# EAGLE design pck100clone (EAGLE 6.6.0)
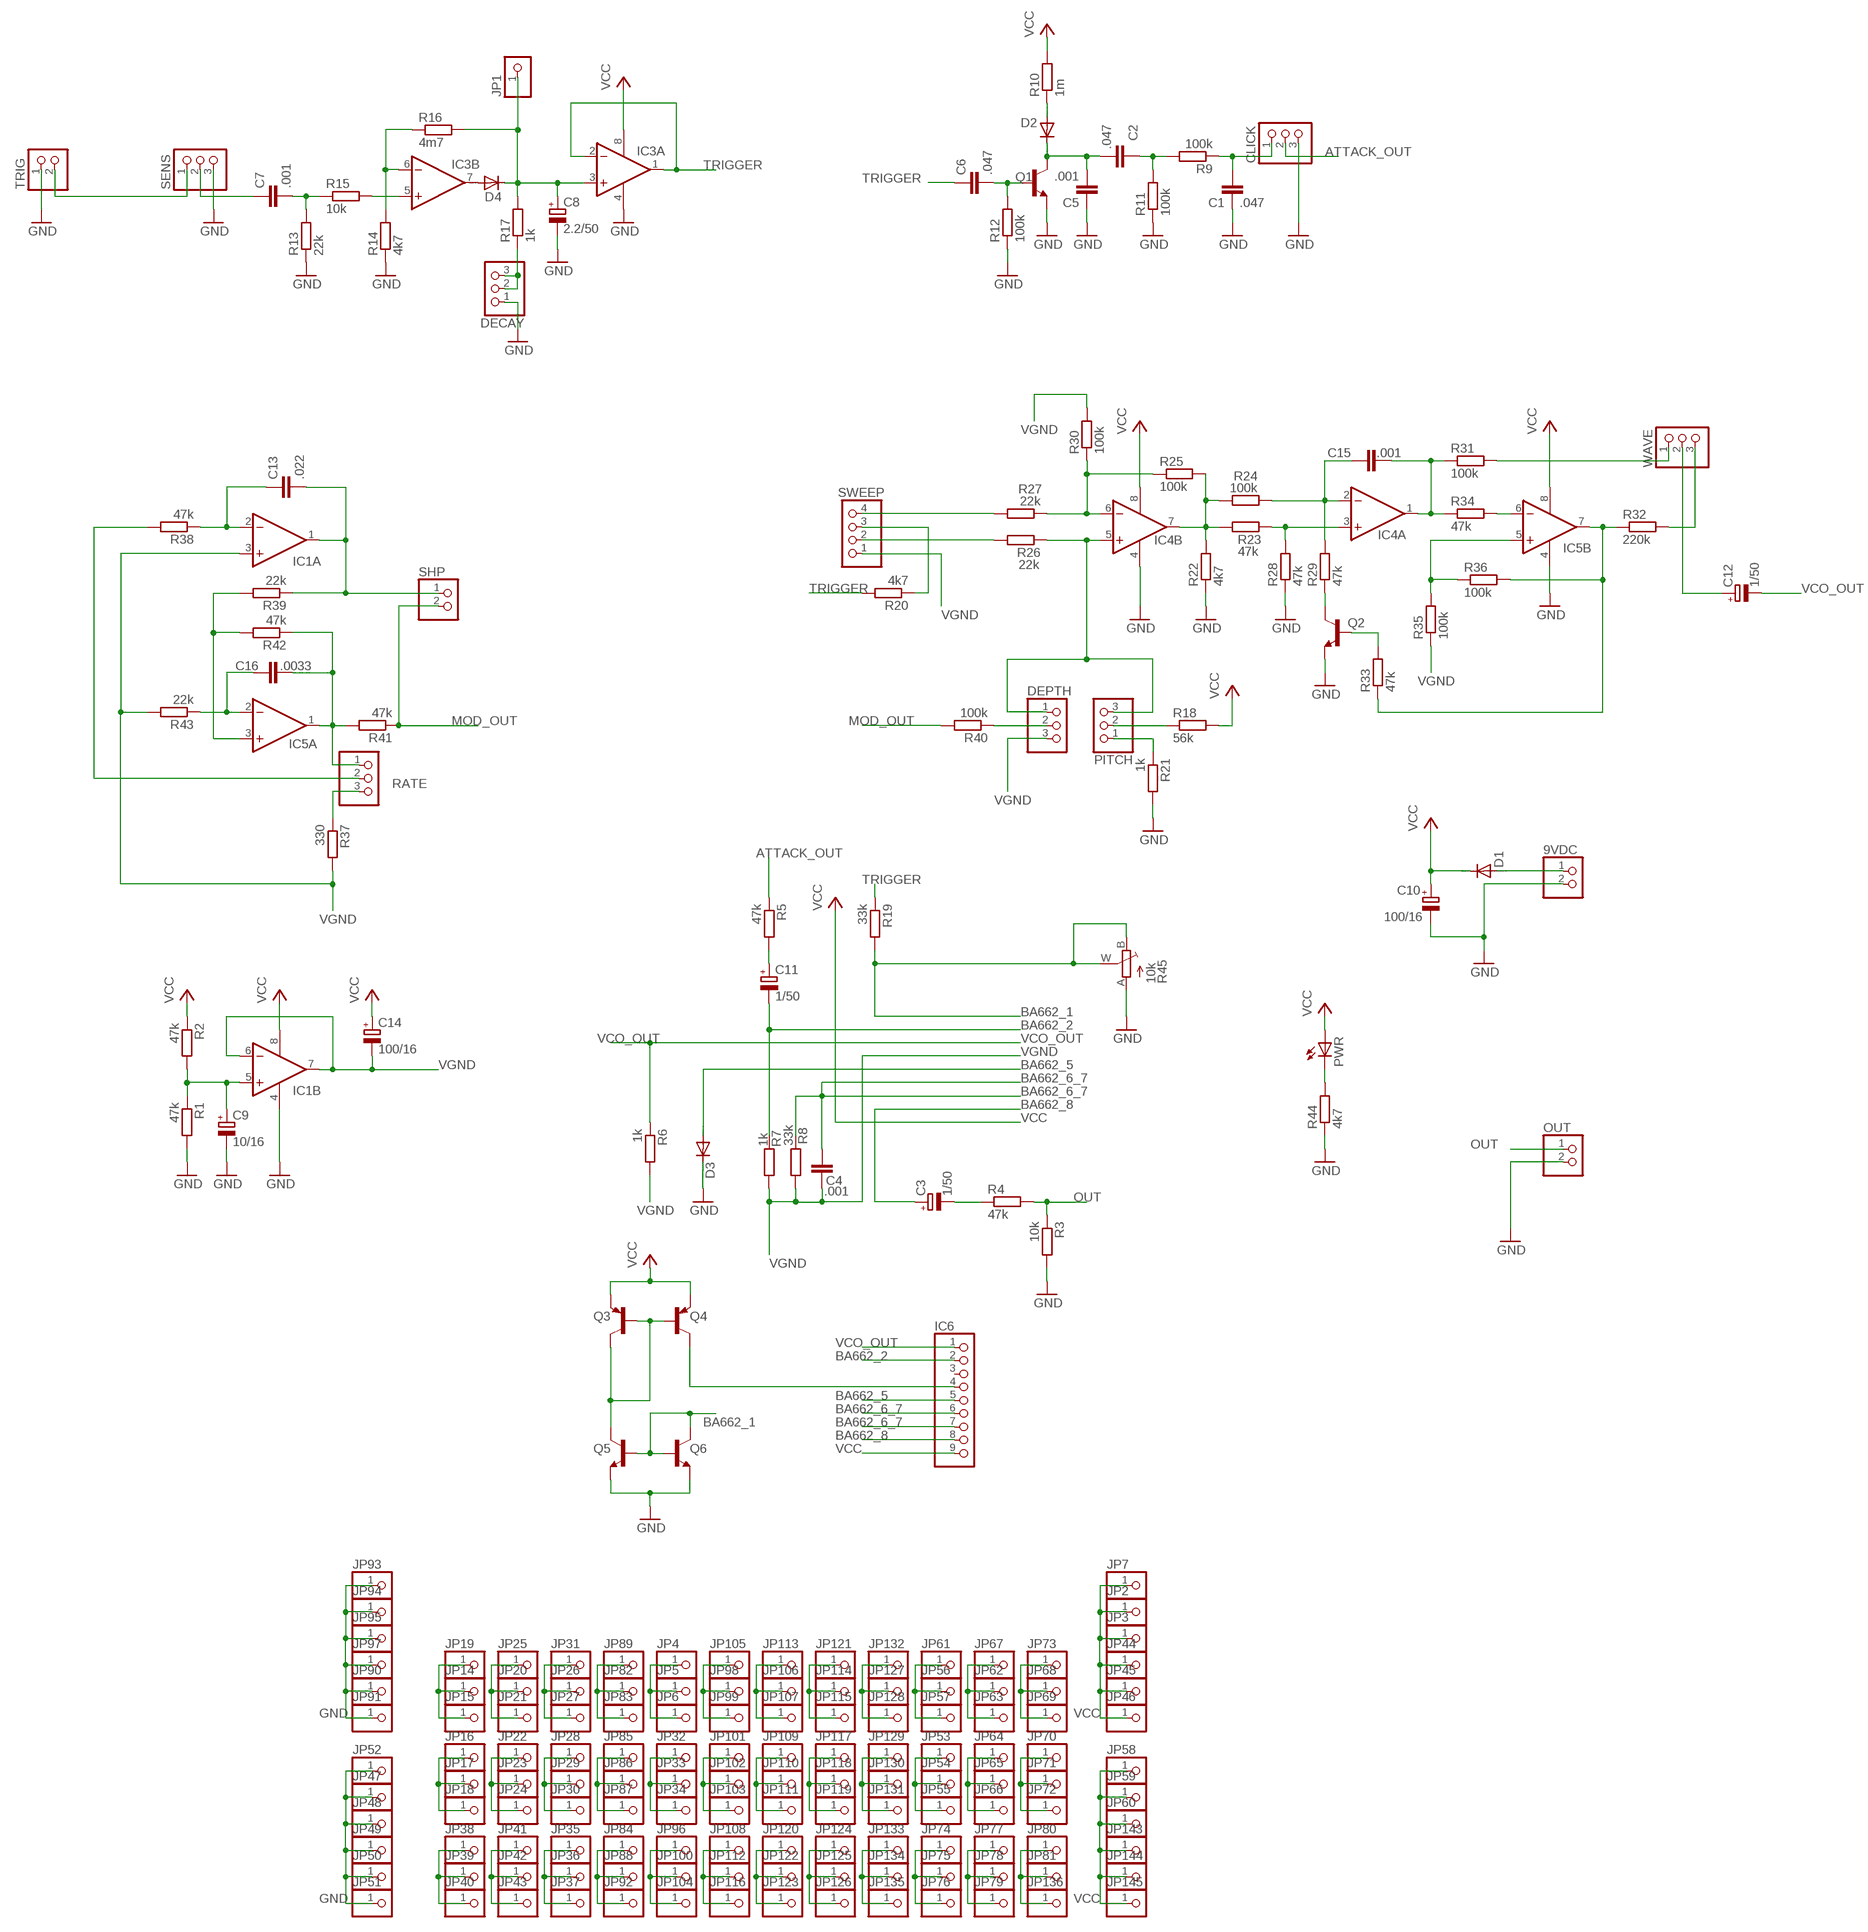
[diagram p0: schematic, sheet 1]

## Parts
9VDC  PINHD-1X2  [1X02]
C1  .047  C-EU050-025X075  [C050-025X075]
C2  .047  C-EU050-025X075  [C050-025X075]
C3  1/50  CPOL-EUE2.5-5  [E2,5-5]
C4  .001  C-EU050-025X075  [C050-025X075]
C5  .001  C-EU050-025X075  [C050-025X075]
C6  .047  C-EU050-025X075  [C050-025X075]
C7  .001  C-EU050-025X075  [C050-025X075]
C8  2.2/50  CPOL-EUE2.5-5  [E2,5-5]
C9  10/16  CPOL-EUE2.5-5  [E2,5-5]
C10  100/16  CPOL-EUE2.5-5  [E2,5-5]
C11  1/50  CPOL-EUE2.5-5  [E2,5-5]
C12  1/50  CPOL-EUE2.5-5  [E2,5-5]
C13  .022  C-EU050-025X075  [C050-025X075]
C14  100/16  CPOL-EUE2.5-5  [E2,5-5]
C15  .001  C-EU050-025X075  [C050-025X075]
C16  .0033  C-EU050-025X075  [C050-025X075]
CLICK  PINHD-1X3  [1X03]
D1  1N4004  [DO41-10]
D2  1N4148DO35-7  [DO35-7]
D3  1N4148DO35-7  [DO35-7]
D4  1N4148DO35-7  [DO35-7]
DECAY  PINHD-1X3  [1X03]
DEPTH  PINHD-1X3  [1X03]
IC1  LM358N  [DIL08]
IC3  LM358N  [DIL08]
IC4  LM358N  [DIL08]
IC5  LM358N  [DIL08]
IC6  PINHD-1X9  [1X09]
JP1  PINHD-1X1  [1X01]
JP2  PINHD-1X1  [1X01]
JP3  PINHD-1X1  [1X01]
JP4  PINHD-1X1  [1X01]
JP5  PINHD-1X1  [1X01]
JP6  PINHD-1X1  [1X01]
JP7  PINHD-1X1  [1X01]
JP14  PINHD-1X1  [1X01]
JP15  PINHD-1X1  [1X01]
JP16  PINHD-1X1  [1X01]
JP17  PINHD-1X1  [1X01]
JP18  PINHD-1X1  [1X01]
JP19  PINHD-1X1  [1X01]
JP20  PINHD-1X1  [1X01]
JP21  PINHD-1X1  [1X01]
JP22  PINHD-1X1  [1X01]
JP23  PINHD-1X1  [1X01]
JP24  PINHD-1X1  [1X01]
JP25  PINHD-1X1  [1X01]
JP26  PINHD-1X1  [1X01]
JP27  PINHD-1X1  [1X01]
JP28  PINHD-1X1  [1X01]
JP29  PINHD-1X1  [1X01]
JP30  PINHD-1X1  [1X01]
JP31  PINHD-1X1  [1X01]
JP32  PINHD-1X1  [1X01]
JP33  PINHD-1X1  [1X01]
JP34  PINHD-1X1  [1X01]
JP35  PINHD-1X1  [1X01]
JP36  PINHD-1X1  [1X01]
JP37  PINHD-1X1  [1X01]
JP38  PINHD-1X1  [1X01]
JP39  PINHD-1X1  [1X01]
JP40  PINHD-1X1  [1X01]
JP41  PINHD-1X1  [1X01]
JP42  PINHD-1X1  [1X01]
JP43  PINHD-1X1  [1X01]
JP44  PINHD-1X1  [1X01]
JP45  PINHD-1X1  [1X01]
JP46  PINHD-1X1  [1X01]
JP47  PINHD-1X1  [1X01]
JP48  PINHD-1X1  [1X01]
JP49  PINHD-1X1  [1X01]
JP50  PINHD-1X1  [1X01]
JP51  PINHD-1X1  [1X01]
JP52  PINHD-1X1  [1X01]
JP53  PINHD-1X1  [1X01]
JP54  PINHD-1X1  [1X01]
JP55  PINHD-1X1  [1X01]
JP56  PINHD-1X1  [1X01]
JP57  PINHD-1X1  [1X01]
JP58  PINHD-1X1  [1X01]
JP59  PINHD-1X1  [1X01]
JP60  PINHD-1X1  [1X01]
JP61  PINHD-1X1  [1X01]
JP62  PINHD-1X1  [1X01]
JP63  PINHD-1X1  [1X01]
JP64  PINHD-1X1  [1X01]
JP65  PINHD-1X1  [1X01]
JP66  PINHD-1X1  [1X01]
JP67  PINHD-1X1  [1X01]
JP68  PINHD-1X1  [1X01]
JP69  PINHD-1X1  [1X01]
JP70  PINHD-1X1  [1X01]
JP71  PINHD-1X1  [1X01]
JP72  PINHD-1X1  [1X01]
JP73  PINHD-1X1  [1X01]
JP74  PINHD-1X1  [1X01]
JP75  PINHD-1X1  [1X01]
JP76  PINHD-1X1  [1X01]
JP77  PINHD-1X1  [1X01]
JP78  PINHD-1X1  [1X01]
JP79  PINHD-1X1  [1X01]
JP80  PINHD-1X1  [1X01]
JP81  PINHD-1X1  [1X01]
JP82  PINHD-1X1  [1X01]
JP83  PINHD-1X1  [1X01]
JP84  PINHD-1X1  [1X01]
JP85  PINHD-1X1  [1X01]
JP86  PINHD-1X1  [1X01]
JP87  PINHD-1X1  [1X01]
JP88  PINHD-1X1  [1X01]
JP89  PINHD-1X1  [1X01]
JP90  PINHD-1X1  [1X01]
JP91  PINHD-1X1  [1X01]
JP92  PINHD-1X1  [1X01]
JP93  PINHD-1X1  [1X01]
JP94  PINHD-1X1  [1X01]
JP95  PINHD-1X1  [1X01]
JP96  PINHD-1X1  [1X01]
JP97  PINHD-1X1  [1X01]
JP98  PINHD-1X1  [1X01]
JP99  PINHD-1X1  [1X01]
JP100  PINHD-1X1  [1X01]
JP101  PINHD-1X1  [1X01]
JP102  PINHD-1X1  [1X01]
JP103  PINHD-1X1  [1X01]
JP104  PINHD-1X1  [1X01]
JP105  PINHD-1X1  [1X01]
JP106  PINHD-1X1  [1X01]
JP107  PINHD-1X1  [1X01]
JP108  PINHD-1X1  [1X01]
JP109  PINHD-1X1  [1X01]
JP110  PINHD-1X1  [1X01]
JP111  PINHD-1X1  [1X01]
JP112  PINHD-1X1  [1X01]
JP113  PINHD-1X1  [1X01]
JP114  PINHD-1X1  [1X01]
JP115  PINHD-1X1  [1X01]
JP116  PINHD-1X1  [1X01]
JP117  PINHD-1X1  [1X01]
JP118  PINHD-1X1  [1X01]
JP119  PINHD-1X1  [1X01]
JP120  PINHD-1X1  [1X01]
JP121  PINHD-1X1  [1X01]
JP122  PINHD-1X1  [1X01]
JP123  PINHD-1X1  [1X01]
JP124  PINHD-1X1  [1X01]
JP125  PINHD-1X1  [1X01]
JP126  PINHD-1X1  [1X01]
JP127  PINHD-1X1  [1X01]
JP128  PINHD-1X1  [1X01]
JP129  PINHD-1X1  [1X01]
JP130  PINHD-1X1  [1X01]
JP131  PINHD-1X1  [1X01]
JP132  PINHD-1X1  [1X01]
JP133  PINHD-1X1  [1X01]
JP134  PINHD-1X1  [1X01]
JP135  PINHD-1X1  [1X01]
JP136  PINHD-1X1  [1X01]
JP143  PINHD-1X1  [1X01]
JP144  PINHD-1X1  [1X01]
JP145  PINHD-1X1  [1X01]
OUT  PINHD-1X2  [1X02]
PITCH  PINHD-1X3  [1X03]
PWR  LED3MM  [LED3MM]
Q1  2SC945  [TO92-ECB]
Q2  2SC945  [TO92-ECB]
Q3  2N3906  [TO92]
Q4  2N3906  [TO92]
Q5  2N3904  [TO92]
Q6  2N3904  [TO92]
R1  47k  R-EU_0207/7  [0207/7]
R2  47k  R-EU_0207/7  [0207/7]
R3  10k  R-EU_0207/7  [0207/7]
R4  47k  R-EU_0207/7  [0207/7]
R5  47k  R-EU_0207/7  [0207/7]
R6  1k  R-EU_0207/7  [0207/7]
R7  1k  R-EU_0207/7  [0207/7]
R8  33k  R-EU_0207/7  [0207/7]
R9  100k  R-EU_0207/7  [0207/7]
R10  1m  R-EU_0207/7  [0207/7]
R11  100k  R-EU_0207/7  [0207/7]
R12  100k  R-EU_0207/7  [0207/7]
R13  22k  R-EU_0207/7  [0207/7]
R14  4k7  R-EU_0207/7  [0207/7]
R15  10k  R-EU_0207/7  [0207/7]
R16  4m7  R-EU_0207/7  [0207/7]
R17  1k  R-EU_0207/7  [0207/7]
R18  56k  R-EU_0207/7  [0207/7]
R19  33k  R-EU_0207/7  [0207/7]
R20  4k7  R-EU_0207/7  [0207/7]
R21  1k  R-EU_0207/7  [0207/7]
R22  4k7  R-EU_0207/7  [0207/7]
R23  47k  R-EU_0207/7  [0207/7]
R24  100k  R-EU_0207/7  [0207/7]
R25  100k  R-EU_0207/7  [0207/7]
R26  22k  R-EU_0207/7  [0207/7]
R27  22k  R-EU_0207/7  [0207/7]
R28  47k  R-EU_0207/7  [0207/7]
R29  47k  R-EU_0207/7  [0207/7]
R30  100k  R-EU_0207/7  [0207/7]
R31  100k  R-EU_0207/7  [0207/7]
R32  220k  R-EU_0207/7  [0207/7]
R33  47k  R-EU_0207/7  [0207/7]
R34  47k  R-EU_0207/7  [0207/7]
R35  100k  R-EU_0207/7  [0207/7]
R36  100k  R-EU_0207/7  [0207/7]
R37  330  R-EU_0207/7  [0207/7]
R38  47k  R-EU_0207/7  [0207/7]
R39  22k  R-EU_0207/7  [0207/7]
R40  100k  R-EU_0207/7  [0207/7]
R41  47k  R-EU_0207/7  [0207/7]
R42  47k  R-EU_0207/7  [0207/7]
R43  22k  R-EU_0207/7  [0207/7]
R44  4k7  R-EU_0207/7  [0207/7]
R45  10k  TRIM_EU-  [TRIM-N]
RATE  PINHD-1X3  [1X03]
SENS  PINHD-1X3  [1X03]
SHP  PINHD-1X2  [1X02]
SWEEP  PINHD-1X4  [1X04]
TRIG  PINHD-1X2  [1X02]
WAVE  PINHD-1X3  [1X03]

## Nets
ATTACK_OUT: CLICK.2 R5.1
BA662_1: Q5.2(B) Q6.1(C) Q6.2(B) R19.2 R45.B(E) R45.W(S)
BA662_2: C11.- IC6.2 R7.1
BA662_5: D3.A IC6.5
BA662_6_7: C4.2 IC6.6 IC6.7 R8.1
BA662_8: C3.+ IC6.8
GND: 9VDC.2 C1.1 C5.1 C8.- C9.- C10.- CLICK.3 D3.C DECAY.1 IC1.4(P:V-) IC3.4(P:V-) IC4.4(P:V-) IC5.4(P:V-) JP47.1 JP48.1 JP49.1 JP50.1 JP51.1 JP52.1 JP90.1 JP91.1 JP93.1 JP94.1 JP95.1 JP97.1 OUT.2 Q1.E Q2.E Q5.3(E) Q6.3(E) R1.2 R3.2 R11.1 R12.1 R13.1 R14.1 R21.2 R22.1 R28.1 R44.1 R45.A SENS.3 TRIG.1
MOD_OUT: R40.2 R41.1 SHP.2
N$1: SENS.1 TRIG.2
N$2: 9VDC.1 D1.A
N$3: C7.1 SENS.2
N$4: C7.2 R13.2 R15.1
N$5: IC3.5(B:+IN) R15.2
N$6: IC3.6(B:-IN) R14.2 R16.1
N$7: D4.A IC3.7(B:OUT)
N$8: C8.+ D4.C IC3.3(A:+IN) JP1.1 R16.2 R17.2
N$9: DECAY.2 DECAY.3 R17.1
N$10: C6.2 Q1.B R12.2
N$11: C2.2 C5.2 D2.C Q1.C
N$12: D2.A R10.1
N$13: C2.1 R9.2 R11.2
N$14: C1.2 CLICK.1 R9.1
N$15: C13.2 IC1.1(A:OUT) R39.1 SHP.1
N$16: C13.1 IC1.2(A:-IN) R38.1
N$17: R38.2 RATE.2
N$18: JP4.1 JP5.1 JP6.1
N$19: C16.1 IC5.2(A:-IN) R43.1
N$20: C16.2 IC5.1(A:OUT) R41.2 R42.1 RATE.1
N$21: R20.1 SWEEP.3
N$22: R37.1 RATE.3
N$23: IC5.3(A:+IN) R39.2 R42.2
N$24: R27.2 SWEEP.4
N$25: R26.2 SWEEP.2
N$26: IC4.6(B:-IN) R25.1 R27.1 R30.1
N$27: DEPTH.1 IC4.5(B:+IN) PITCH.3 R26.1
N$28: DEPTH.2 R40.1
N$29: PITCH.2 R18.1
N$30: PITCH.1 R21.1
N$31: C9.+ IC1.5(B:+IN) R1.1 R2.2
N$32: IC4.7(B:OUT) R22.2 R23.1 R24.1 R25.2
N$33: IC4.3(A:+IN) R23.2 R28.2
N$34: C15.2 IC4.2(A:-IN) R24.2 R29.2
N$35: Q2.C R29.1
N$36: Q2.B R33.2
N$37: C15.1 IC4.1(A:OUT) R31.1 R34.1
N$38: IC5.6(B:-IN) R34.2
N$39: R31.2 WAVE.1
N$40: IC5.7(B:OUT) R32.1 R33.1 R36.2
N$41: R32.2 WAVE.3
N$42: IC5.5(B:+IN) R35.2 R36.1
N$43: C12.+ WAVE.2
N$44: PWR.K(C) R44.2
N$45: IC6.4 Q4.1(C)
N$47: C11.+ R5.2
N$48: Q3.1(C) Q3.2(B) Q4.2(B) Q5.1(C)
N$50: JP14.1 JP15.1 JP19.1
N$51: C3.- R4.1
N$52: JP16.1 JP17.1 JP18.1
N$53: JP20.1 JP21.1 JP25.1
N$54: JP22.1 JP23.1 JP24.1
N$55: JP26.1 JP27.1 JP31.1
N$56: JP28.1 JP29.1 JP30.1
N$57: JP32.1 JP33.1 JP34.1
N$58: JP35.1 JP36.1 JP37.1
N$59: JP38.1 JP39.1 JP40.1
N$60: JP41.1 JP42.1 JP43.1
N$64: JP53.1 JP54.1 JP55.1
N$65: JP56.1 JP57.1 JP61.1
N$67: JP62.1 JP63.1 JP67.1
N$68: JP64.1 JP65.1 JP66.1
N$69: JP68.1 JP69.1 JP73.1
N$70: JP70.1 JP71.1 JP72.1
N$71: JP74.1 JP75.1 JP76.1
N$72: JP77.1 JP78.1 JP79.1
N$73: JP80.1 JP81.1 JP136.1
N$89: JP98.1 JP99.1 JP105.1
N$90: JP82.1 JP83.1 JP89.1
N$91: JP85.1 JP86.1 JP87.1
N$92: JP101.1 JP102.1 JP103.1
N$93: JP106.1 JP107.1 JP113.1
N$94: JP109.1 JP110.1 JP111.1
N$95: JP114.1 JP115.1 JP121.1
N$96: JP117.1 JP118.1 JP119.1
N$97: JP84.1 JP88.1 JP92.1
N$98: JP96.1 JP100.1 JP104.1
N$99: JP108.1 JP112.1 JP116.1
N$100: JP120.1 JP122.1 JP123.1
N$101: JP124.1 JP125.1 JP126.1
N$102: JP127.1 JP128.1 JP132.1
N$103: JP129.1 JP130.1 JP131.1
N$104: JP133.1 JP134.1 JP135.1
OUT: OUT.1 R3.1 R4.2
TRIGGER: C6.1 IC3.1(A:OUT) IC3.2(A:-IN) R19.1 R20.2
VCC: C10.+ C14.+ D1.C IC1.8(P:V+) IC3.8(P:V+) IC4.8(P:V+) IC5.8(P:V+) IC6.9 JP2.1 JP3.1 JP7.1 JP44.1 JP45.1 JP46.1 JP58.1 JP59.1 JP60.1 JP143.1 JP144.1 JP145.1 PWR.A Q3.3(E) Q4.3(E) R2.1 R10.2 R18.2
VCO_OUT: C12.- IC6.1 R6.1
VGND: C4.1 C14.- DEPTH.3 IC1.3(A:+IN) IC1.6(B:-IN) IC1.7(B:OUT) R6.2 R7.2 R8.2 R30.2 R35.1 R37.2 R43.2 SWEEP.1
Unconnected: IC6.3

## Library data of the parts
9VDC OUT SHP TRIG = pinhead:PINHD-1X2: PIN HEADER
C1 C2 C4-C7 C13 C15 C16 = rcl:C-EU: CAPACITOR, European symbol
C3 C8-C12 C14 = rcl:CPOL-EU: POLARIZED CAPACITOR, European symbol
CLICK DECAY DEPTH PITCH RATE SENS WAVE = pinhead:PINHD-1X3: PIN HEADER
D1 = diode:1N4004: DIODE general purpose rectifier, 1 A
D2-D4 = diode:1N4148: DIODE high speed (Philips)
IC1 IC3-IC5 = linear:LM358: OP AMP also LM158; LM258; LM2904 Source: http://cache.national.com/ds/LM/LM158.pdf
IC6 = pinhead:PINHD-1X9: PIN HEADER
JP1-JP7 JP14-JP136 JP143-JP145 = pinhead:PINHD-1X1: PIN HEADER
PWR = led:LED: LED OSRAM: - CHIPLED LG R971, LG N971, LY N971, LG Q971, LY Q971, LO R971, LY R971 LH N974, LH R974 LS Q976, LO Q976, LY Q976 LO Q996 - Hyper CHIPLED LW Q18S LB Q993, LB Q99A, LB R99A - SideLED LS A670, LO A670, LY A670, LG A670, LP A670 LB A673, LV A673, LT A673, LW A673 LH A674 LY A675 LS A676, LA A676, LO A676, LY A676, LW A676 LS A679, LY A679, LG A679 - Hyper Micro SIDELED® LS Y876, LA Y876, LO Y876, LY Y876 LT Y87S - SmartLED LW L88C, LW L88S LB L89C, LB L89S, LG L890 LS L89K, LO L89K, LY L89K LS L896, LA L896, LO L896, LY L896 - TOPLED LS T670, LO T670, LY T670, LG T670, LP T670 LSG T670, LSP T670, LSY T670, LOP T670, LYG T670 LG T671, LOG T671, LSG T671 LB T673, LV T673, LT T673, LW T673 LH T674 LS T676, LA T676, LO T676, LY T676, LB T676, LH T676, LSB T676, LW T676 LB T67C, LV T67C, LT T67C, LS T67K, LO T67K, LY T67K, LW E67C LS E67B, LA E67B, LO E67B, LY E67B, LB E67C, LV E67C, LT E67C LW T67C LS T679, LY T679, LG T679 LS T770, LO T770, LY T770, LG T770, LP T770 LB T773, LV T773, LT T773, LW T773 LH T774 LS E675, LA E675, LY E675, LS T675 LS T776, LA T776, LO T776, LY T776, LB T776 LHGB T686 LT T68C, LB T68C - Hyper Mini TOPLED® LB M676 - Mini TOPLED Santana® LG M470 LS M47K, LO M47K, LY M47K Source: http://www.osram.convergy.de LUXEON: - LUMILED® LXK2-PW12-R00, LXK2-PW12-S00, LXK2-PW14-U00, LXK2-PW14-V00 LXK2-PM12-R00, LXK2-PM12-S00, LXK2-PM14-U00 LXK2-PE12-Q00, LXK2-PE12-R00, LXK2-PE12-S00, LXK2-PE14-T00, LXK2-PE14-U00 LXK2-PB12-K00, LXK2-PB12-L00, LXK2-PB12-M00, LXK2-PB14-N00, LXK2-PB14-P00, LXK2-PB14-Q00 LXK2-PR12-L00, LXK2-PR12-M00, LXK2-PR14-Q00, LXK2-PR14-R00 LXK2-PD12-Q00, LXK2-PD12-R00, LXK2-PD12-S00 LXK2-PH12-R00, LXK2-PH12-S00 LXK2-PL12-P00, LXK2-PL12-Q00, LXK2-PL12-R00 Source: www.luxeon.com KINGBRIGHT: KA-3528ASYC Source: www.kingbright.com
Q1 Q2 = transistor:2SC945: NPN Silicon Epitaxial Planar Transistor Source: SEMTECH ELECTRONICS LTD. ... 2SC945 2.pdf
Q3 Q4 = transistor-pnp:2N3906: PNP Transistor
Q5 Q6 = transistor:2N3904: NPN TRANSISTOR
R1-R44 = rcl:R-EU_: RESISTOR, European symbol
R45 = jason_eagle6:TRIM_EU-: POTENTIOMETER
SWEEP = pinhead:PINHD-1X4: PIN HEADER

## Board
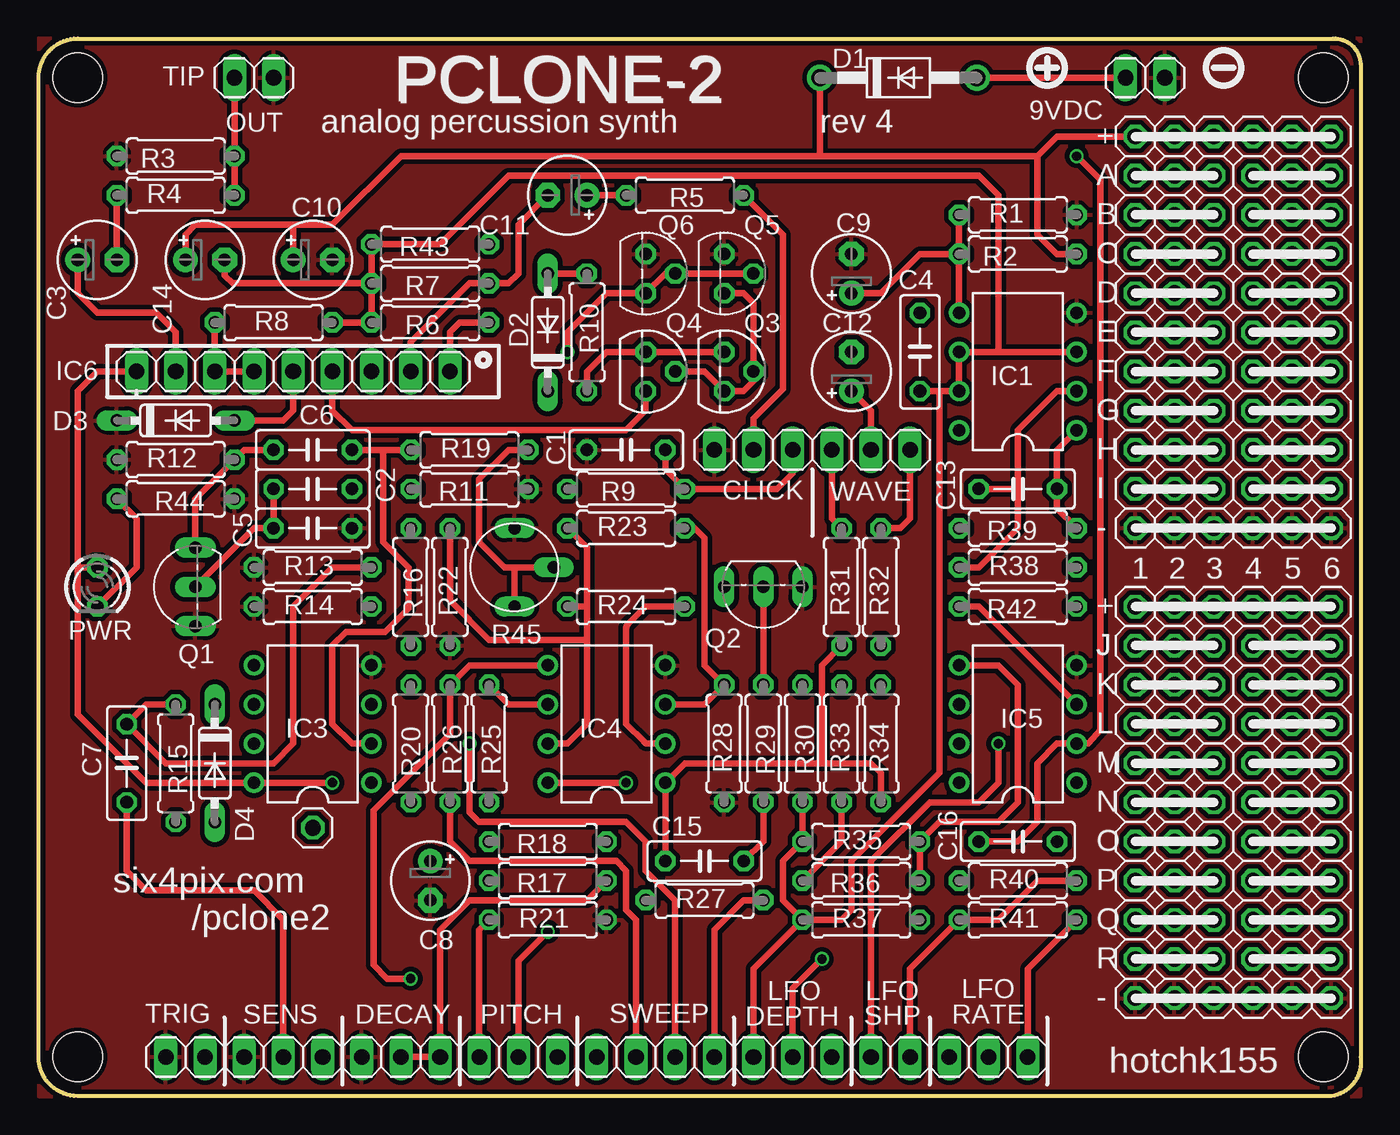
[diagram p1: board, top side]
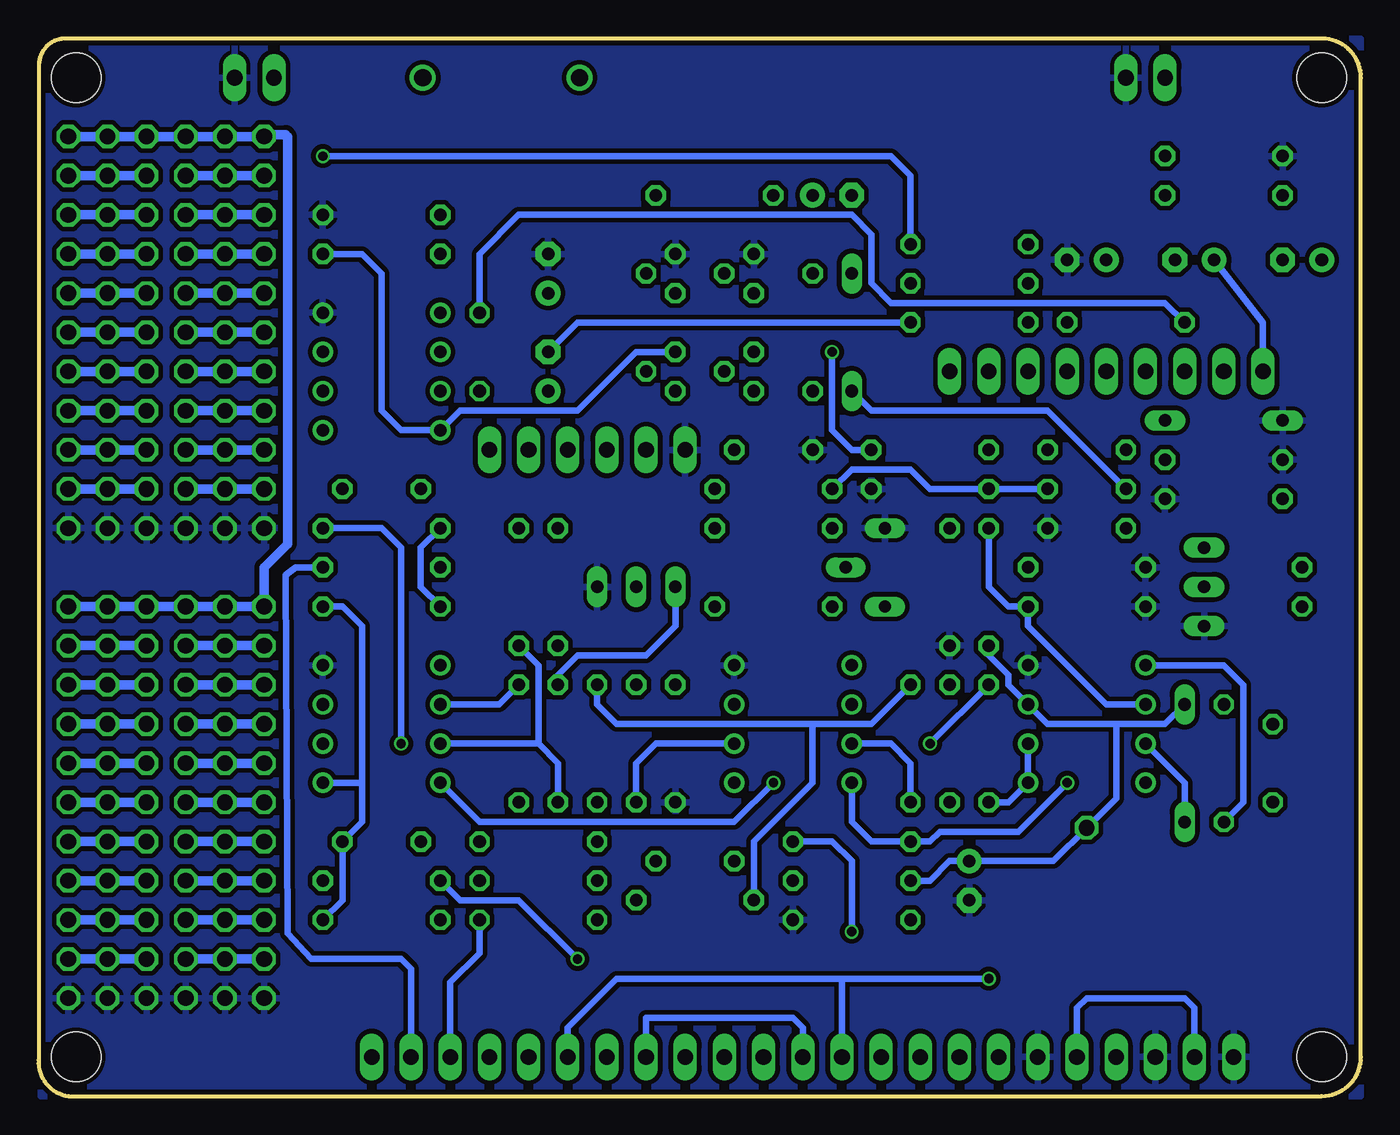
[diagram p2: board, bottom side, seen from below]

Size 85.75 x 68.58 mm. Coordinates in mm from the lower left corner, seen from the top.
Outline: 2.54,68.58 83.95,68.58 arc-90 85.72,66.93 85.72,2.54 arc-90 83.82,0 2.54,0 arc-90 0,2.54 0,66.04 arc-90 2.54,68.58
Copper layers (1*16): Top 0.035mm / dielectric 1.5mm / Bottom 0.035mm
Design rules "hackvana": minimum track width 6mil, minimum drill 0.3mm, track to track 6mil, track to pad 9mil, pad to pad 6mil, via to via 6mil, smd to smd 0mil, copper to edge 6mil, drill to drill 6mil, minimum pad ring 10mil, minimum via ring 6mil, stop-mask expansion 2mil, vias tented up to drill 100mil, thermal gap 10mil
Holes 3.2 mm at 83.31,66.04 83.31,2.54 2.54,2.54 2.54,66.04

### Footprints (pad centres in the part's own frame; a part is rotated, then mirrored left to right if it is on the bottom)
1X02 = drill 1.016 long: 1 -1.27,0; 2 1.27,0
C050-025X075 = drill 0.813 octagon: 1 -2.54,0; 2 2.54,0
E2,5-5 = drill 0.813 pad 1.6: + -1.27,0 | drill 0.813 pad 1.6 octagon: - 1.27,0
1X03 = drill 1.016 long: 1 -2.54,0; 2 0,0; 3 2.54,0
DO41-10 = drill 1.118: A 5.08,0; C -5.08,0
DO35-7 = drill 0.813 long: A 3.81,0; C -3.81,0
DIL08 = drill 0.813 pad 1.27: 1 -3.81,-3.81; 2 -1.27,-3.81; 3 1.27,-3.81; 4 3.81,-3.81; 5 3.81,3.81; 6 1.27,3.81; 7 -1.27,3.81; 8 -3.81,3.81
1X09 = drill 1.016 long: 1 -10.16,0; 2 -7.62,0; 3 -5.08,0; 4 -2.54,0; 5 0,0; 6 2.54,0; 7 5.08,0; 8 7.62,0; 9 10.16,0
1X01 = drill 1.016 octagon: 1 0,0
LED3MM = drill 0.813 octagon: A -1.27,0; K 1.27,0
TO92-ECB = drill 0.813 long: B 2.54,0; C 0,0; E -2.54,0
TO92 = drill 0.813 octagon: 1 1.27,0; 2 0,1.905; 3 -1.27,0
0207/7 = drill 0.813 octagon: 1 -3.81,0; 2 3.81,0
TRIM-N = drill 0.8 long: A 0,-2.54; B 0,2.54; W -2.54,0
1X04 = drill 1.016 long: 1 -3.81,0; 2 -1.27,0; 3 1.27,0; 4 3.81,0

### Placement (x,y rotation side)
9VDC  71.75,66.04 0 top
C1  38.1,41.91 0 top
C2  17.78,39.37 180 top
C3  3.81,54.23 0 top
C4  57.15,48.26 90 top
C5  17.78,36.83 180 top
C6  17.78,41.91 180 top
C7  5.71,21.59 90 top
C8  25.4,13.97 270 top
C9  52.7,53.34 90 top
C10  17.78,54.23 0 top
C11  34.29,58.42 180 top
C12  52.7,46.99 90 top
C13  63.5,39.37 0 top
C14  10.79,54.23 0 top
C15  43.18,15.24 0 top
C16  63.5,16.51 0 top
CLICK  46.35,41.91 180 top
D1  55.75,66.04 0 top
D2  33.02,49.53 90 top
D3  8.89,43.81 0 top
D4  11.43,21.59 270 top
DECAY  23.49,2.54 0 top
DEPTH  48.89,2.54 180 top
IC1  63.5,46.99 90 top
IC3  17.78,24.13 90 top
IC4  36.83,24.13 90 top
IC5  63.5,24.13 90 top
IC6  16.51,46.99 180 top
JP1  17.78,17.4 0 top
JP2  73.66,31.75 0 top
JP3  76.2,31.75 0 top
JP4  76.2,29.21 0 top
JP5  71.12,29.21 0 top
JP6  73.66,29.21 0 top
JP7  71.12,31.75 0 top
JP14  73.66,49.53 0 top
JP15  76.2,49.53 0 top
JP16  81.28,46.99 0 top
JP17  83.82,46.99 0 top
JP18  78.74,46.99 0 top
JP19  71.12,49.53 0 top
JP20  73.66,44.45 0 top
JP21  76.2,44.45 0 top
JP22  78.74,49.53 0 top
JP23  81.28,49.53 0 top
JP24  83.82,49.53 0 top
JP25  71.12,44.45 0 top
JP26  78.74,44.45 0 top
JP27  81.28,44.45 0 top
JP28  71.12,46.99 0 top
JP29  73.66,46.99 0 top
JP30  76.2,46.99 0 top
JP31  83.82,44.45 0 top
JP32  71.12,41.91 0 top
JP33  73.66,41.91 0 top
JP34  76.2,41.91 0 top
JP35  78.74,41.91 0 top
JP36  81.28,41.91 0 top
JP37  83.82,41.91 0 top
JP38  76.2,39.37 0 top
JP39  71.12,39.37 0 top
JP40  73.66,39.37 0 top
JP41  78.74,39.37 0 top
JP42  81.28,39.37 0 top
JP43  83.82,39.37 0 top
JP44  81.28,31.75 0 top
JP45  83.82,31.75 0 top
JP46  78.74,31.75 0 top
JP47  71.12,36.83 0 top
JP48  73.66,36.83 0 top
JP49  78.74,36.83 0 top
JP50  81.28,36.83 0 top
JP51  83.82,36.83 0 top
JP52  76.2,36.83 0 top
JP53  78.74,29.21 0 top
JP54  81.28,29.21 0 top
JP55  83.82,29.21 0 top
JP56  78.74,59.69 0 top
JP57  81.28,59.69 0 top
JP58  71.12,62.23 0 top
JP59  73.66,62.23 0 top
JP60  76.2,62.23 0 top
JP61  83.82,59.69 0 top
JP62  78.74,57.15 0 top
JP63  81.28,57.15 0 top
JP64  71.12,59.69 0 top
JP65  73.66,59.69 0 top
JP66  76.2,59.69 0 top
JP67  83.82,57.15 0 top
JP68  78.74,54.61 0 top
JP69  81.28,54.61 0 top
JP70  73.66,57.15 0 top
JP71  71.12,57.15 0 top
JP72  76.2,57.15 0 top
JP73  83.82,54.61 0 top
JP74  78.74,52.07 0 top
JP75  81.28,52.07 0 top
JP76  83.82,52.07 0 top
JP77  71.12,54.61 0 top
JP78  73.66,54.61 0 top
JP79  76.2,54.61 0 top
JP80  73.66,52.07 0 top
JP81  71.12,52.07 0 top
JP82  81.28,8.89 0 top
JP83  83.82,8.89 0 top
JP84  76.2,19.05 0 top
JP85  76.2,8.89 0 top
JP86  71.12,8.89 0 top
JP87  73.66,8.89 0 top
JP88  71.12,19.05 0 top
JP89  78.74,8.89 0 top
JP90  81.28,6.35 0 top
JP91  83.82,6.35 0 top
JP92  73.66,19.05 0 top
JP93  76.2,6.35 0 top
JP94  71.12,6.35 0 top
JP95  73.66,6.35 0 top
JP96  78.74,19.05 0 top
JP97  78.74,6.35 0 top
JP98  71.12,13.97 0 top
JP99  73.66,13.97 0 top
JP100  83.82,19.05 0 top
JP101  83.82,13.97 0 top
JP102  78.74,13.97 0 top
JP103  81.28,13.97 0 top
JP104  81.28,19.05 0 top
JP105  76.2,13.97 0 top
JP106  73.66,11.43 0 top
JP107  76.2,11.43 0 top
JP108  76.2,21.59 0 top
JP109  83.82,11.43 0 top
JP110  81.28,11.43 0 top
JP111  78.74,11.43 0 top
JP112  71.12,21.59 0 top
JP113  71.12,11.43 0 top
JP114  78.74,16.51 0 top
JP115  81.28,16.51 0 top
JP116  73.66,21.59 0 top
JP117  76.2,16.51 0 top
JP118  71.12,16.51 0 top
JP119  73.66,16.51 0 top
JP120  71.12,24.13 0 top
JP121  83.82,16.51 0 top
JP122  73.66,24.13 0 top
JP123  76.2,24.13 0 top
JP124  78.74,21.59 0 top
JP125  81.28,21.59 0 top
JP126  83.82,21.59 0 top
JP127  78.74,26.67 0 top
JP128  81.28,26.67 0 top
JP129  73.66,26.67 0 top
JP130  76.2,26.67 0 top
JP131  71.12,26.67 0 top
JP132  83.82,26.67 0 top
JP133  81.28,24.13 0 top
JP134  83.82,24.13 0 top
JP135  78.74,24.13 0 top
JP136  76.2,52.07 0 top
JP143  81.28,62.23 0 top
JP144  83.82,62.23 0 top
JP145  78.74,62.23 0 top
OUT  13.97,66.04 0 top
PITCH  31.12,2.54 0 top
PWR  3.81,33.02 270 top
Q1  10.16,33.02 90 top
Q2  46.99,33.02 180 top
Q3  44.45,46.99 270 top
Q4  39.37,46.99 270 top
Q5  44.45,53.34 270 top
Q6  39.37,53.34 270 top
R1  63.5,57.15 0 top
R2  63.5,54.61 180 top
R3  8.89,60.96 180 top
R4  8.89,58.42 0 top
R5  41.91,58.42 180 top
R6  25.4,50.16 180 top
R7  25.4,52.7 180 top
R8  15.24,50.16 0 top
R9  38.1,39.37 180 top
R10  35.56,49.53 270 top
R11  27.94,39.37 180 top
R12  8.89,41.27 0 top
R13  17.78,34.29 0 top
R14  17.78,31.75 0 top
R15  8.89,21.59 270 top
R16  24.13,33.02 270 top
R17  33.02,13.97 180 top
R18  33.02,16.51 180 top
R19  27.94,41.91 0 top
R20  24.13,22.86 270 top
R21  33.02,11.43 0 top
R22  26.67,33.02 90 top
R23  38.1,36.83 0 top
R24  38.1,31.75 0 top
R25  29.21,22.86 270 top
R26  26.67,22.86 270 top
R27  43.18,12.7 0 top
R28  44.45,22.86 90 top
R29  46.99,22.86 270 top
R30  49.53,22.86 270 top
R31  52.07,33.02 90 top
R32  54.61,33.02 90 top
R33  52.07,22.86 90 top
R34  54.61,22.86 90 top
R35  53.34,16.51 0 top
R36  53.34,13.97 180 top
R37  53.34,11.43 180 top
R38  63.5,34.29 0 top
R39  63.5,36.83 180 top
R40  63.5,13.97 0 top
R41  63.5,11.43 0 top
R42  63.5,31.75 180 top
R43  25.4,55.24 180 top
R44  8.89,38.73 180 top
R45  30.86,34.29 180 top
RATE  61.59,2.54 180 top
SENS  15.88,2.54 180 top
SHP  55.25,2.54 0 top
SWEEP  40.01,2.54 0 top
TRIG  9.52,2.54 0 top
WAVE  53.98,41.91 0 top

### Tracks (layer width: path | path; a pad name or v marks a point on that pad's centre or on a via)
ATTACK_OUT
  Top 0.406: R5.1 48.26,55.88 48.26,45.85 46.35,43.94 CLICK.2
BA662_1  (via drill 0.6)
  Top 0.406: Q5.2 Q6.2 40.64,53.34 Q6.1 36.83,52.07 34.29,49.53 v34.29,48.26 | R19.2 30.48,41.91 28.58,40 28.58,35.94 30.23,34.29 30.99,34.29 | 30.99,34.29 R45.W | R45.B 30.86,34.16 30.99,34.29
  Bottom 0.406: R19.2 33.02,41.91 34.29,43.18 v34.29,48.26
BA662_2
  Top 0.406: IC6.2 24.13,48.89 27.94,52.7 R7.1 30.48,52.7 31.12,53.34 31.12,56.51 C11.-
BA662_5
  Top 0.406: D3.A 15.88,43.81 16.51,44.45 IC6.5
BA662_6_7
  Top 0.406: R8.1 IC6.7 IC6.6
  Bottom 0.406: C4.2 57.15,54.61 54.61,57.15 33.02,57.15 31.75,55.88 31.75,52.7 30.48,51.43 12.7,51.43 R8.1
BA662_8
  Top 0.406: IC6.8 8.89,49.53 7.62,50.8 3.81,50.8 2.54,52.07 C3.+
GND
  pour Bottom (isolate 0.305): 0,68.58 85.72,68.58 85.6,0 0,0
  pour Top (isolate 0.305): 0,68.58 0,0 85.72,0 85.72,68.58
MOD_OUT
  Top 0.406: R40.2 64.77,13.97 62.23,11.43 R41.1 56.52,8.26 SHP.2
N$1
  Bottom 0.406: TRIG.2 10.79,5.71 11.43,6.35 17.78,6.35 18.41,5.71 SENS.1
N$2
  Top 0.406: D1.A 9VDC.1
N$3
  Top 0.406: C7.1 5.71,14.61 6.98,13.34 13.97,13.34 15.88,11.43 SENS.2
N$4
  Top 0.406: R15.1 6.98,25.4 C7.2 8.25,21.59 15.24,21.59 16.51,22.86 16.51,31.75 19.05,34.29 R13.2
N$5
  Bottom 0.406: IC3.5 8.89,27.94 7.62,26.67 7.62,19.05 R15.2
N$6
  Bottom 0.406: IC3.6 16.51,25.4 21.59,30.48 R14.2 22.86,31.75 24.13,33.02 R16.1
N$7
  Bottom 0.406: D4.A 11.43,20.32 IC3.7
N$8
  Bottom 0.406: 15.88,24.13 20.32,24.13 IC3.3 22.86,26.67 22.86,27.3 24.13,28.57 R16.2 | 15.88,24.13 12.7,24.13 D4.C | R17.2 27.94,13.97 26.67,15.24 C8.+ 19.94,15.24 JP1.1 15.88,19.3 15.88,24.13
N$9
  Top 0.406: DECAY.2 DECAY.3 26.03,10.79 27.94,12.7 35.56,12.7 R17.1
N$10
  Top 0.406: C6.2 13.34,41.91 R12.2 10.16,38.73 Q1.B
N$11
  Top 0.406: C2.2 C5.2 13.97,36.83 Q1.C
  Bottom 0.406: C2.2 20.32,44.45 31.75,44.45 D2.C
N$12
  Top 0.406: D2.A R10.1
N$13
  Bottom 0.406: R9.2 33.02,40.64 29.21,40.64 27.94,39.37 R11.2 C2.1
N$14
  Top 0.406: C1.2 40.64,40.64 R9.1 47.88,39.37 48.89,40.39 CLICK.1
N$15  (via drill 0.6)
  Top 0.406: v62.23,22.86 62.23,20.32 60.96,19.05 57.78,19.05 53.98,15.24 SHP.1 | R39.1 66.04,38.1 C13.2 66.04,41.91 IC1.1
  Bottom 0.406: v62.23,22.86 62.23,35.56 63.5,36.83 R39.1
N$16
  Top 0.406: R38.1 60.96,34.29 63.5,36.83 63.5,39.37 | 63.5,39.37 63.5,43.18 66.04,45.72 IC1.2 | C13.1 63.5,39.37
N$17
  Bottom 0.406: R38.2 69.09,34.29 69.72,33.78 69.6,10.54 68.07,8.89 62.23,8.89 61.59,8.26 RATE.2
N$18
  Bottom 0.61: JP5.1 JP6.1 JP4.1
N$19  (via drill 0.6)
  Top 0.406: C16.1 63.5,16.51 64.77,17.78 64.77,21.59 66.04,22.86 IC5.2 68.07,22.86 68.83,23.75 68.83,59.44 v67.31,60.96
  Bottom 0.406: v67.31,60.96 30.48,60.96 29.21,59.69 R43.1
N$20
  Top 0.406: RATE.1 64.14,8.26 R41.2
  Bottom 0.406: 64.77,20.32 64.77,17.78 C16.2 66.04,12.7 R41.2 | 64.77,20.32 64.77,30.48 66.04,31.75 R42.1 | IC5.1 64.77,20.32
N$21  (via drill 0.6)
  Top 0.406: v27.94,22.86 27.94,18.41 28.58,17.78 38.1,17.78 39.37,16.51 39.37,14.61 41.27,12.7 SWEEP.3
  Bottom 0.406: v27.94,22.86 R20.1
N$22
  Bottom 0.406: RATE.3 59.05,7.37 57.15,9.27 R37.1
N$23
  Top 0.406: R42.2 60.96,31.75 IC5.3
  Bottom 0.406: R42.2 60.96,33.02 60.96,35.56 R39.2
N$24
  Top 0.406: SWEEP.4 43.81,10.79 45.72,12.7 R27.2
N$25
  Top 0.406: R26.2 26.67,16.51 27.94,15.24 37.46,15.24 38.1,14.61 38.1,12.07 38.73,11.43 SWEEP.2
N$26
  Top 0.406: IC4.6 30.48,25.4 R25.1
  Bottom 0.406: R25.1 31.75,24.13 35.56,24.13 | R30.1 49.53,25.4 48.26,24.13 35.56,24.13 | R27.1 39.37,16.51 35.56,20.32 35.56,24.13
N$27  (via drill 0.6)
  Top 0.406: IC4.5 27.94,27.94 R26.1 26.67,23.5 21.72,18.54 21.72,8.51 22.61,7.62 v24.13,7.62
  Bottom 0.406: DEPTH.1 51.44,4.45 48.26,7.62 33.66,7.62 | 33.66,7.62 v24.13,7.62 | PITCH.3 33.66,7.62
N$28  (via drill 0.6)
  Top 0.406: DEPTH.2 48.89,6.99 v50.8,8.89
  Bottom 0.406: R40.1 58.42,12.7 54.61,12.7 v50.8,8.89
N$29  (via drill 0.6)
  Top 0.406: PITCH.2 31.12,8.76 31.5,9.14 v33.02,10.67
  Bottom 0.406: R18.1 34.29,16.51 33.02,15.24 v33.02,10.67
N$30
  Top 0.406: R21.1 28.58,10.79 PITCH.1
N$31
  Top 0.406: R2.2 IC1.5 | R2.2 R1.1 | C9.+ 54.61,52.07 57.15,54.61 R2.2
N$32
  Top 0.406: IC4.7 34.29,22.86 35.56,24.13 35.56,29.59 | 35.56,29.59 35.56,31.75 | R23.1 35.56,35.56 35.56,31.75 | R24.1 35.56,31.75 | R22.2 26.67,32.13 29.21,29.59 35.56,29.59
  Bottom 0.406: R25.2 29.21,21.59 30.48,22.86 IC4.7
N$33
  Top 0.406: IC4.3 43.18,25.4 R28.2 43.18,27.94 43.18,36.2 42.55,36.83 R23.2
N$34
  Top 0.406: R29.2 46.99,16.51 C15.2 | IC4.2 39.5,22.86 arc-45 39.28,22.95 38.1,24.13 38.1,30.35 arc-45 38.19,30.57 39.37,31.75 R24.2
  Bottom 0.406: IC4.2 45.72,22.86 46.99,21.59 R29.2
N$35
  Top 0.406: R29.1 Q2.C
N$36
  Bottom 0.406: Q2.B 44.45,30.48 46.35,28.57 50.8,28.57 52.07,27.3 R33.2
N$37
  Top 0.406: 50.8,21.59 41.91,21.59 IC4.1 C15.1 | 50.8,21.59 53.98,21.59 54.61,20.96 R34.1 | R31.1 50.8,27.94 50.8,21.59
N$38
  Bottom 0.406: IC5.6 55.88,25.4 R34.2
N$39
  Top 0.406: WAVE.1 51.44,37.46 R31.2
N$40
  Top 0.406: R33.1 52.07,16.51 R36.2
  Bottom 0.406: IC5.7 53.34,22.86 | 53.34,22.86 52.07,21.59 R33.1 | R32.1 53.34,27.94 53.34,22.86
N$41
  Top 0.406: WAVE.3 56.52,37.46 55.88,36.83 R32.2
N$42
  Top 0.406: R36.1 R35.2 58.42,17.78 62.23,17.78 63.5,19.05 63.5,26.67 62.23,27.94 IC5.5
N$43
  Top 0.406: WAVE.2 53.98,44.45 C12.+
N$44
  Top 0.406: PWR.K 6.35,34.29 6.35,37.46 R44.2
N$45
  Top 0.406: Q4.1 39.37,44.45 38.1,43.18 20.32,43.18 19.05,44.45 IC6.4
N$47
  Top 0.406: C11.+ R5.2
N$48
  Top 0.406: Q4.2 43.18,46.99 Q3.1 45.72,45.72 46.35,46.35 Q3.2 46.35,51.43 45.72,52.07 Q5.1
N$50
  Bottom 0.61: JP19.1 JP14.1 JP15.1
N$51
  Top 0.406: C3.- R4.1
N$52
  Bottom 0.61: JP18.1 JP16.1 JP17.1
N$53
  Bottom 0.61: JP25.1 JP20.1 JP21.1
N$54
  Bottom 0.61: JP22.1 JP23.1 JP24.1
N$55
  Bottom 0.61: JP26.1 JP27.1 JP31.1
N$56
  Bottom 0.61: JP28.1 JP29.1 JP30.1
N$57
  Bottom 0.61: JP32.1 JP33.1 JP34.1
N$58
  Bottom 0.61: JP35.1 JP36.1 JP37.1
N$59
  Bottom 0.61: JP39.1 JP40.1 JP38.1
N$60
  Bottom 0.61: JP41.1 JP42.1 JP43.1
N$64
  Bottom 0.61: JP53.1 JP54.1 JP55.1
N$65
  Bottom 0.61: JP56.1 JP57.1 JP61.1
N$67
  Bottom 0.61: JP62.1 JP63.1 JP67.1
N$68
  Bottom 0.61: JP64.1 JP65.1 JP66.1
N$69
  Bottom 0.61: JP68.1 JP69.1 JP73.1
N$70
  Bottom 0.61: JP71.1 JP70.1 JP72.1
N$71
  Bottom 0.61: JP74.1 JP75.1 JP76.1
N$72
  Bottom 0.61: JP77.1 JP78.1 JP79.1
N$73
  Bottom 0.61: JP81.1 JP80.1 JP136.1
N$89
  Bottom 0.61: JP98.1 JP99.1 JP105.1
N$90
  Bottom 0.61: JP89.1 JP82.1 JP83.1
N$91
  Bottom 0.61: JP86.1 JP87.1 JP85.1
N$92
  Bottom 0.61: JP102.1 JP103.1 JP101.1
N$93
  Bottom 0.61: JP113.1 JP106.1 JP107.1
N$94
  Bottom 0.61: JP111.1 JP110.1 JP109.1
N$95
  Bottom 0.61: JP114.1 JP115.1 JP121.1
N$96
  Bottom 0.61: JP118.1 JP119.1 JP117.1
N$97
  Bottom 0.61: JP88.1 JP92.1 JP84.1
N$98
  Bottom 0.61: JP96.1 JP104.1 JP100.1
N$99
  Bottom 0.61: JP112.1 JP116.1 JP108.1
N$100
  Bottom 0.61: JP120.1 JP122.1 JP123.1
N$101
  Bottom 0.61: JP124.1 JP125.1 JP126.1
N$102
  Bottom 0.61: JP127.1 JP128.1 JP132.1
N$103
  Bottom 0.61: JP131.1 JP129.1 JP130.1
N$104
  Bottom 0.61: JP135.1 JP133.1 JP134.1
OUT
  Top 0.406: R4.2 R3.1 OUT.1
TRIGGER
  Top 0.406: C6.1 22.48,41.91 | 22.48,41.91 R19.1 | IC3.2 20.32,22.86 19.05,24.13 19.05,29.21 19.94,30.1 22.48,30.1 24,31.62 24,34.29 22.35,35.94 22.35,41.78 22.48,41.91
  Bottom 0.406: R20.2 22.86,19.05 IC3.1 IC3.2
VCC  (via drill 0.6)
  Top 0.406: Q3.3 Q4.3 36.83,48.26 35.56,46.99 R10.2 | IC6.9 3.81,46.99 2.54,45.72 2.54,34.29 | 16.51,56.51 10.16,56.51 9.52,55.88 C14.+ | 16.51,56.51 19.05,56.51 23.49,60.96 50.8,60.96 | 15.24,20.32 IC3.8 | PWR.A 2.54,34.29 | C10.+ 16.51,56.51 | R2.1 66.04,54.61 64.77,55.88 64.77,60.96 | v38.1,20.32 IC4.8 | v19.05,20.32 IC3.8 | 2.54,34.29 2.54,24.77 6.98,20.32 IC3.8 | 50.8,60.96 64.77,60.96 | D1.C 50.67,61.09 50.8,60.96 | 64.77,60.96 66.04,62.23 JP58.1
  Bottom 0.406: IC6.9 6.35,50.16 C14.+ | R2.1 64.77,54.61 63.5,53.34 63.5,44.45 62.23,43.18 IC1.8 58.42,44.45 50.8,44.45 46.99,48.26 Q3.3 | IC5.8 57.15,17.78 40.64,17.78 v38.1,20.32 | IC4.8 33.02,17.78 31.75,16.51 R18.2 27.94,16.51 27.3,17.14 22.22,17.14 v19.05,20.32
  Bottom 0.61: JP144.1 JP143.1 JP145.1 JP60.1 JP59.1 JP58.1 71.12,62.36 69.72,62.36 69.6,62.23 69.6,35.81 71.12,34.29 JP7.1 JP2.1 JP3.1 JP46.1 JP44.1 JP45.1
VCO_OUT
  Top 0.406: R6.1 27.3,50.16 26.67,49.53 IC6.1
  Bottom 0.406: R6.1 50.8,50.16 C12.-
VGND
  Top 0.406: R30.2 R35.1 48.26,15.24 48.26,12.7 R37.2 | C4.1 58.42,45.72 | 58.42,45.72 IC1.7 IC1.6 62.23,48.26 | R8.2 R6.2 R7.2 | 62.23,48.26 IC1.3 | R7.2 12.57,52.7 12.06,53.21 C14.- | R7.2 R43.2 26.03,55.24 30.48,59.69 60.96,59.69 62.23,58.42 62.23,48.26 | 58.42,45.72 58.42,20.96 52.7,15.24 52.7,12.07 52.07,11.43 R37.2 | DEPTH.3 46.35,8.26 R37.2
  Bottom 0.406: SWEEP.1 36.2,4.45 36.83,5.08 46.35,5.08 DEPTH.3

### Text on the board
tPlace: TIP | PCLONE-2 | PCLONE-2 | analog percussion synth | rev 4 | + | A | B | C | D | E | F | G | H | WAVE | I | - | 1 | 2 | 3 | 4 | 5 | 6 | + | J | J | K | L | M | N | O | six4pix.com | P | /pclone2 | Q | R | LFO | LFO | LFO | - | hotchk155